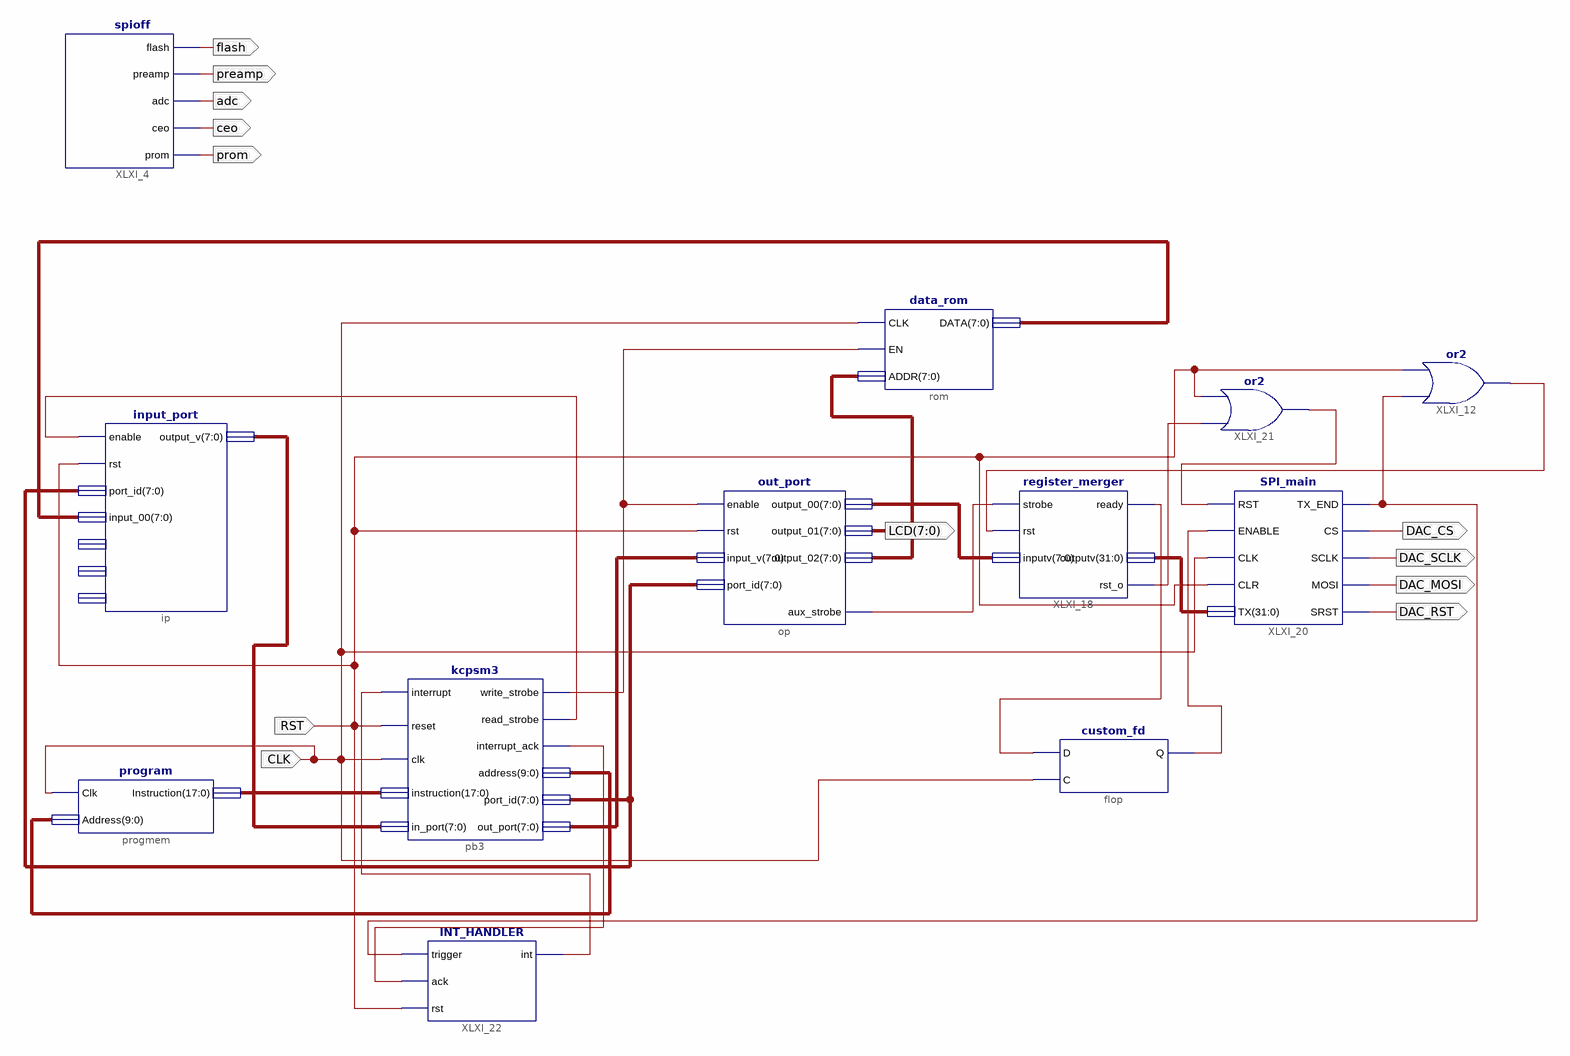
[diagram p0: schematic sheet 1]
// Xilinx ISE schematic main.sch (spartan3e) as structural Verilog: 12 symbols, 12 ports
module main (
  input  CLK,
  input  RST,
  output [7:0] LCD,
  output flash,
  output preamp,
  output adc,
  output ceo,
  output prom,
  output DAC_RST,
  output DAC_MOSI,
  output DAC_SCLK,
  output DAC_CS
);

  wire aux_strobe, wrtstrobe, XLXN_8, XLXN_34, XLXN_73, XLXN_74, XLXN_76, XLXN_77, XLXN_79, XLXN_81, XLXN_82;
  wire [7:0] XLXN_5, XLXN_10, XLXN_11, XLXN_32, XLXN_35, XLXN_38;
  wire [9:0] XLXN_40;
  wire [17:0] XLXN_39;
  wire [31:0] XLXN_29;

  kcpsm3 pb3 (
    .interrupt(XLXN_82), .reset(RST), .clk(CLK), .instruction(XLXN_39), .in_port(XLXN_10),
    .write_strobe(wrtstrobe), .read_strobe(XLXN_8), .interrupt_ack(XLXN_81), .address(XLXN_40),
    .port_id(XLXN_5), .out_port(XLXN_11));
  input_port ip (
    .enable(XLXN_8), .rst(RST), .port_id(XLXN_5), .input_00(XLXN_38), .output_v(XLXN_10));  // open: input_01, input_02, input_03
  out_port op (
    .enable(wrtstrobe), .rst(RST), .input_v(XLXN_11), .port_id(XLXN_5), .output_00(XLXN_32), .output_01(LCD),
    .output_02(XLXN_35), .aux_strobe(aux_strobe));
  spioff XLXI_4 (.flash(flash), .preamp(preamp), .adc(adc), .ceo(ceo), .prom(prom));
  data_rom rom (.CLK(CLK), .EN(wrtstrobe), .ADDR(XLXN_35), .DATA(XLXN_38));
  \program  progmem (.Clk(CLK), .Address(XLXN_40), .Instruction(XLXN_39));
  or XLXI_12 (XLXN_76, XLXN_77, RST);
  custom_fd flop (.D(XLXN_34), .C(CLK), .Q(XLXN_73));
  register_merger XLXI_18 (
    .strobe(aux_strobe), .rst(XLXN_76), .inputv(XLXN_32), .ready(XLXN_34), .outputv(XLXN_29), .rst_o(XLXN_79));
  SPI_main XLXI_20 (
    .RST(XLXN_74), .ENABLE(XLXN_73), .CLK(CLK), .CLR(RST), .TX(XLXN_29), .TX_END(XLXN_77), .CS(DAC_CS),
    .SCLK(DAC_SCLK), .MOSI(DAC_MOSI), .SRST(DAC_RST));
  or XLXI_21 (XLXN_74, XLXN_79, RST);
  INT_HANDLER XLXI_22 (.trigger(XLXN_77), .ack(XLXN_81), .\int (XLXN_82), .rst(RST));
endmodule
